# Altium schematic sheet TOP_SHEET.SchDoc
size A
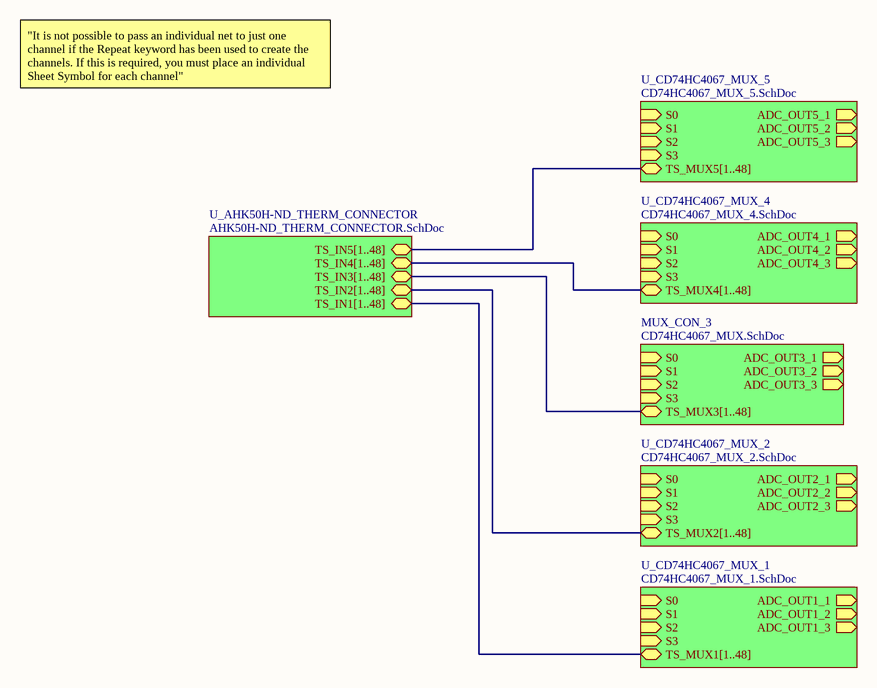
[diagram p0: TOP_SHEET.SchDoc]

## Sub-sheets
MUX_CON_3 = CD74HC4067_MUX.SchDoc: TS_MUX3[1..48] (bidir), S0 (in), S1 (in), S2 (in), S3 (in), ADC_OUT3_1 (out), ADC_OUT3_2 (out), ADC_OUT3_3 (out)
U_AHK50H-ND_THERM_CONNECTOR = AHK50H-ND_THERM_CONNECTOR.SchDoc: TS_IN3[1..48] (bidir), TS_IN2[1..48] (bidir), TS_IN1[1..48] (bidir), TS_IN4[1..48] (bidir), TS_IN5[1..48] (bidir)
U_CD74HC4067_MUX_1 = CD74HC4067_MUX_1.SchDoc: S0 (in), S1 (in), S2 (in), S3 (in), ADC_OUT1_1 (out), ADC_OUT1_2 (out), ADC_OUT1_3 (out), TS_MUX1[1..48] (bidir)
U_CD74HC4067_MUX_2 = CD74HC4067_MUX_2.SchDoc: S0 (in), S1 (in), S2 (in), S3 (in), ADC_OUT2_1 (out), ADC_OUT2_2 (out), ADC_OUT2_3 (out), TS_MUX2[1..48] (bidir)
U_CD74HC4067_MUX_4 = CD74HC4067_MUX_4.SchDoc: S0 (in), S1 (in), S2 (in), S3 (in), ADC_OUT4_1 (out), ADC_OUT4_2 (out), ADC_OUT4_3 (out), TS_MUX4[1..48] (bidir)
U_CD74HC4067_MUX_5 = CD74HC4067_MUX_5.SchDoc: S0 (in), S1 (in), S2 (in), S3 (in), ADC_OUT5_1 (out), ADC_OUT5_2 (out), ADC_OUT5_3 (out), TS_MUX5[1..48] (bidir)

## Buses and harness runs
bus sheet MUX_CON_3/TS_MUX3[1..48] = sheet U_AHK50H-ND_THERM_CONNECTOR/TS_IN3[1..48]
bus sheet U_AHK50H-ND_THERM_CONNECTOR/TS_IN1[1..48] = sheet U_CD74HC4067_MUX_1/TS_MUX1[1..48]
bus sheet U_AHK50H-ND_THERM_CONNECTOR/TS_IN2[1..48] = sheet U_CD74HC4067_MUX_2/TS_MUX2[1..48]
bus sheet U_AHK50H-ND_THERM_CONNECTOR/TS_IN4[1..48] = sheet U_CD74HC4067_MUX_4/TS_MUX4[1..48]
bus sheet U_AHK50H-ND_THERM_CONNECTOR/TS_IN5[1..48] = sheet U_CD74HC4067_MUX_5/TS_MUX5[1..48]

## Notes on the sheet
- "It is not possible to pass an individual net to just one channel if the Repeat keyword has been used to create the channels. If this is required, you must place an individual Sheet Symbol for each channel"